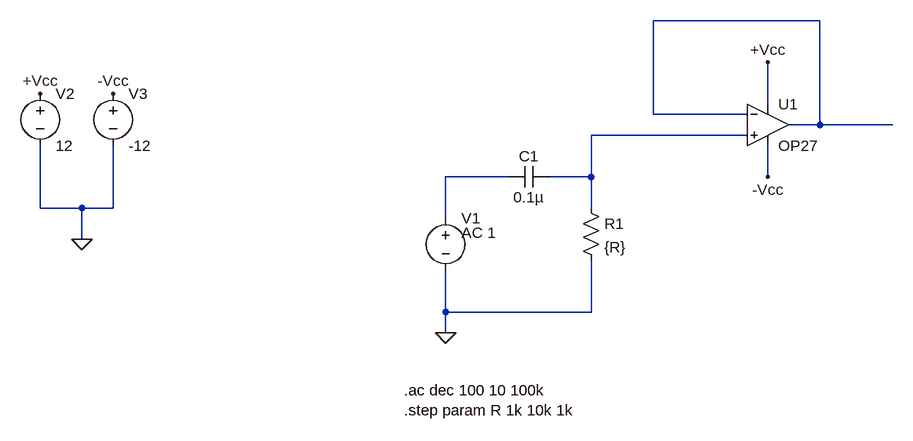
[diagram p0: schematic High_pass.asc]
High_pass.asc, the LTspice schematic file:
Version 4
SHEET 1 948 680
WIRE 832 -64 576 -64
WIRE 752 64 752 0
WIRE 576 80 576 -64
WIRE 720 80 576 80
WIRE 832 96 832 -64
WIRE 832 96 784 96
WIRE 944 96 832 96
WIRE 720 112 480 112
WIRE 352 176 256 176
WIRE 480 176 480 112
WIRE 480 176 416 176
WIRE 752 176 752 128
WIRE -368 224 -368 128
WIRE -304 224 -368 224
WIRE -256 224 -256 128
WIRE -256 224 -304 224
WIRE 480 224 480 176
WIRE 256 240 256 176
WIRE -304 272 -304 224
WIRE 256 384 256 320
WIRE 480 384 480 304
WIRE 480 384 256 384
WIRE 256 416 256 384
FLAG 256 416 0
FLAG -304 272 0
FLAG -368 48 +Vcc
FLAG -256 48 -Vcc
FLAG 752 0 +Vcc
FLAG 752 176 -Vcc
SYMBOL Voltage 256 224 R0
WINDOW 123 24 38 Left 2
SYMATTR InstName V1
SYMATTR Value ""
SYMATTR Value2 AC 1
SYMBOL Res 464 208 R0
SYMATTR InstName R1
SYMATTR Value {R}
SYMBOL Cap 416 160 R90
WINDOW 0 0 32 VBottom 2
WINDOW 3 32 32 VTop 2
SYMATTR InstName C1
SYMATTR Value 0.1µ
SYMBOL OP27 752 32 R0
SYMATTR InstName U1
SYMBOL Voltage -368 32 R0
SYMATTR InstName V2
SYMATTR Value 12
SYMBOL Voltage -256 32 R0
SYMATTR InstName V3
SYMATTR Value -12
TEXT 192 504 Left 2 !.ac dec 100 10 100k\n.step param R 1k 10k 1k

The netlist it stands for:
* High_pass.asc
V1 N003 0 AC 1
R1 N002 0 {R}
C1 N002 N003 0.1µ
XU1 N002 N001 +Vcc -Vcc N001 OP27  ; pins In+ In- V+ V- OUT
V2 +Vcc 0 12
V3 -Vcc 0 -12
.ac dec 100 10 100k
.step param R 1k 10k 1k
.lib ADI.lib
.backanno
.end